# EAGLE design had_ret (EAGLE 6.6.0)
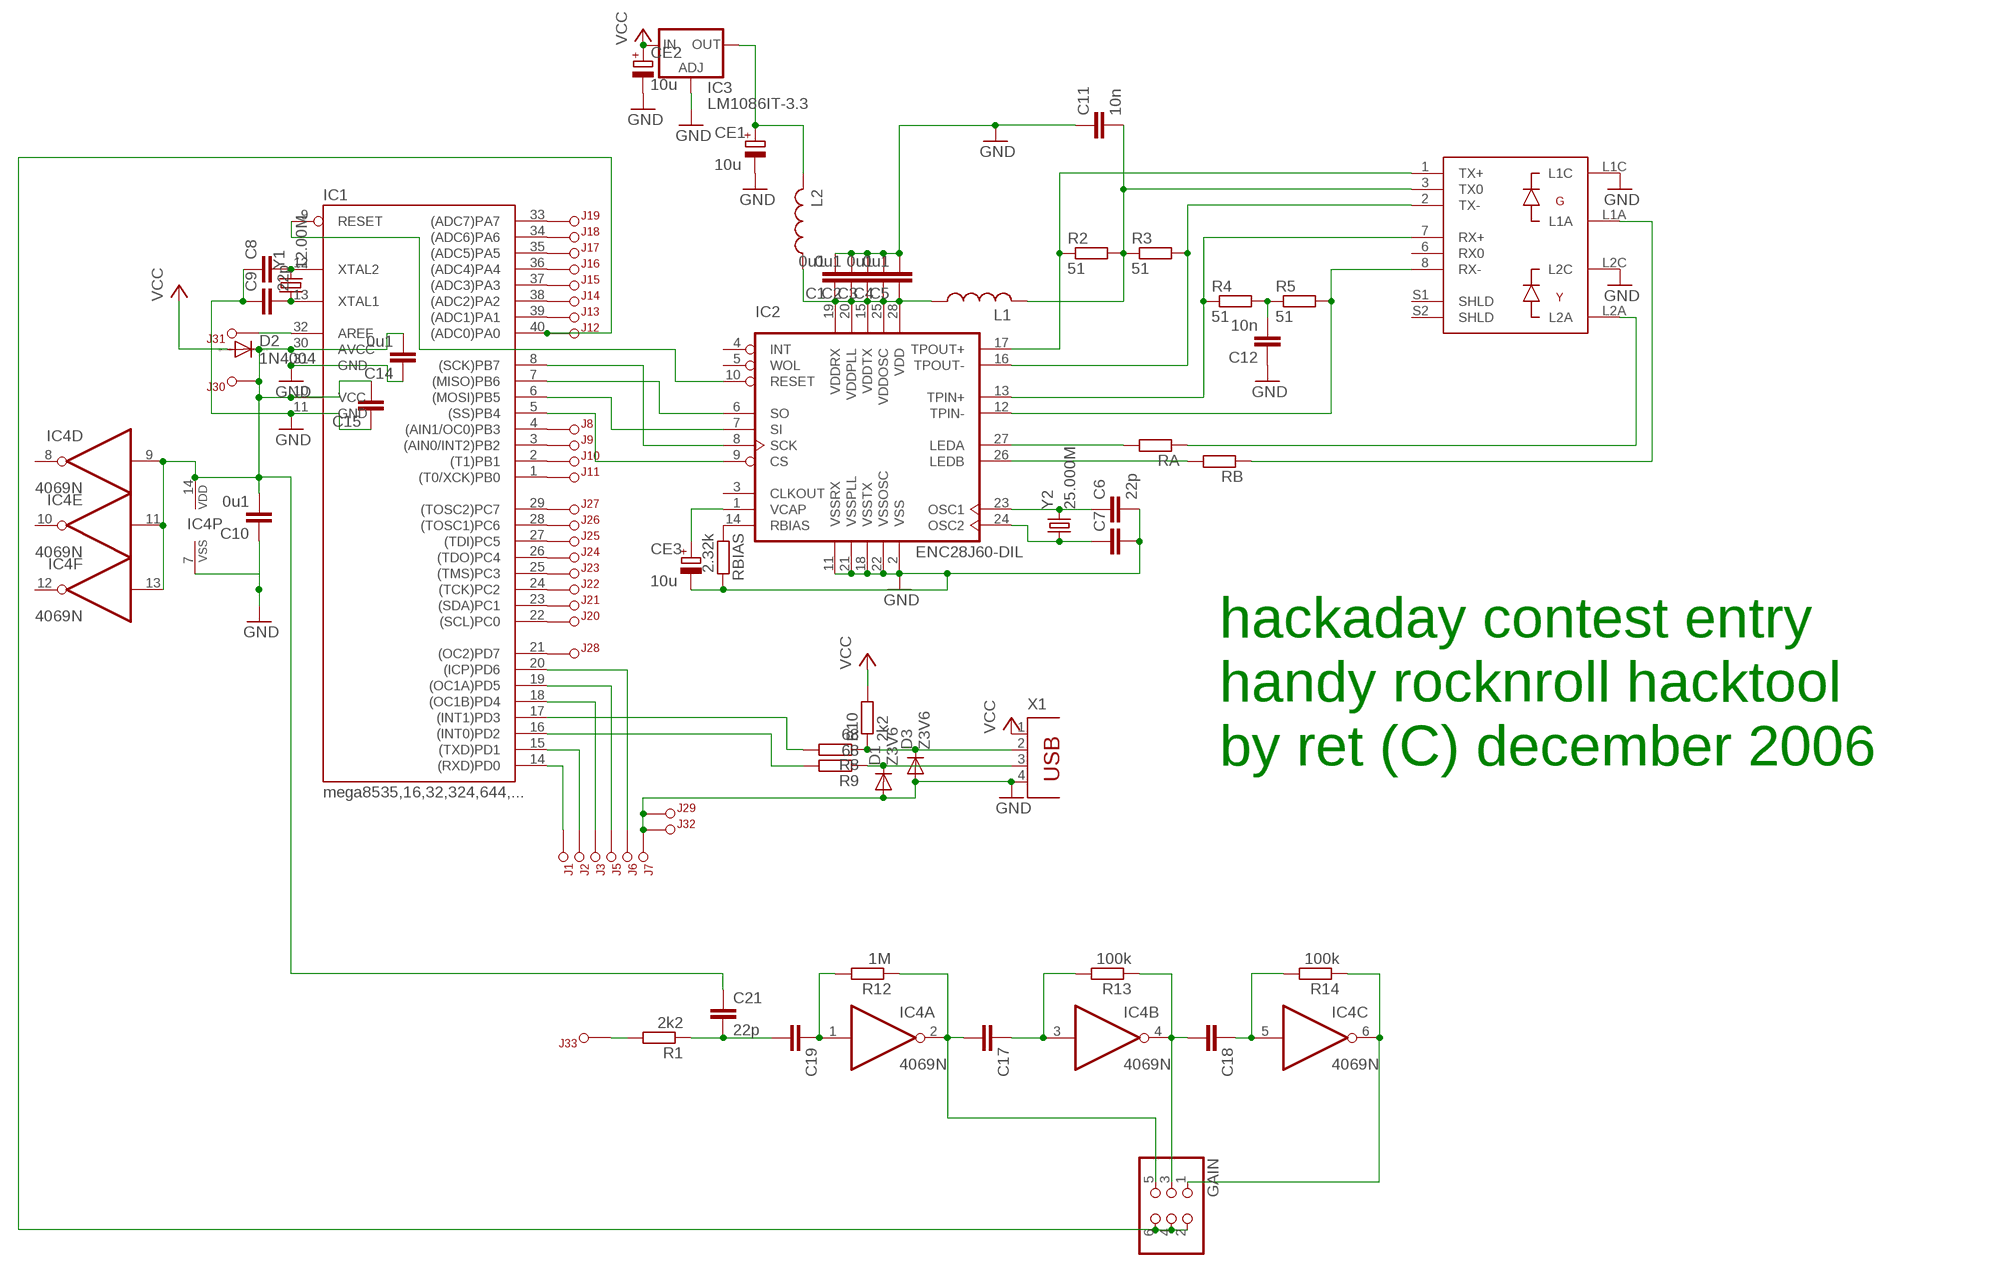
[diagram p0: schematic, sheet 1]

## Parts
C1  0u1  C0805  [0805]
C2  0u1  C0805  [0805]
C3  C0805  [0805]
C4  0u1  C0805  [0805]
C5  0u1  C0805  [0805]
C6  22p  C0805  [0805]
C7  C0805  [0805]
C8  C0805  [0805]
C9  22p  C0805  [0805]
C10  0u1  C0805  [0805]
C11  10n  C0805  [0805]
C12  10n  C0805  [0805]
C14  0u1  C0805  [0805]
C15  C0805  [0805]
C17  C0805  [0805]
C18  C0805  [0805]
C19  C0805  [0805]
C21  22p  C0805  [0805]
CE1  10u  CPOL-EUCT3528  [CT3528]
CE2  10u  CPOL-EUCT3528  [CT3528]
CE3  10u  CPOL-EUCT3528  [CT3528]
D1  Z3V6  DIODE  [DIODE]
D2  1N4004  [DO41-10]
D3  Z3V6  DIODE  [DIODE]
GAIN  PINHD-2X3  [2X03]
IC1  mega8535,16,32,324,644,...  MEGA16-P  [DIL40]
IC2  ENC28J60-DIL  [DIL28-3]
IC3  LM1086IT-3.3  LM317TS  [317TS]
IC4  4069N  [DIL14]
J1  PINMA01  [MA01-1PIN]
J2  PINMA01  [MA01-1PIN]
J3  PINMA01  [MA01-1PIN]
J4  8P8C-TRAF  [8P8C-TRAF]
J5  PINMA01  [MA01-1PIN]
J6  PINMA01  [MA01-1PIN]
J7  PINMA01  [MA01-1PIN]
J8  PINMA01  [MA01-1PIN]
J9  PINMA01  [MA01-1PIN]
J10  PINMA01  [MA01-1PIN]
J11  PINMA01  [MA01-1PIN]
J12  PINMA01  [MA01-1PIN]
J13  PINMA01  [MA01-1PIN]
J14  PINMA01  [MA01-1PIN]
J15  PINMA01  [MA01-1PIN]
J16  PINMA01  [MA01-1PIN]
J17  PINMA01  [MA01-1PIN]
J18  PINMA01  [MA01-1PIN]
J19  PINMA01  [MA01-1PIN]
J20  PINMA01  [MA01-1PIN]
J21  PINMA01  [MA01-1PIN]
J22  PINMA01  [MA01-1PIN]
J23  PINMA01  [MA01-1PIN]
J24  PINMA01  [MA01-1PIN]
J25  PINMA01  [MA01-1PIN]
J26  PINMA01  [MA01-1PIN]
J27  PINMA01  [MA01-1PIN]
J28  PINMA01  [MA01-1PIN]
J29  PINMA01  [MA01-1PIN]
J30  PINMA01  [MA01-1PIN]
J31  PINMA01  [MA01-1PIN]
J32  PINMA01  [MA01-1PIN]
J33  PINMA01  [MA01-1PIN]
L1  L0805  [0805]
L2  L0805  [0805]
R1  2k2  R0805  [0805]
R2  51  R0805  [0805]
R3  51  R0805  [0805]
R4  51  R0805  [0805]
R5  51  R0805  [0805]
R8  68  R0805  [0805]
R9  68  R0805  [0805]
R10  2k2  R0805  [0805]
R12  1M  R0805  [0805]
R13  100k  R0805  [0805]
R14  100k  R0805  [0805]
RA  R-EU_0204/5  [0204/5]
RB  R-EU_0204/5  [0204/5]
RBIAS  2.32k  R-EU_0204/7  [0204/7]
X1  PN61729  [PN61729]
Y1  12.00M  CRYSTALHC49S  [HC49/S]
Y2  25.000M  CRYSTALHC49S  [HC49/S]

## Nets
+3V3: CE1.+ IC3.2(OUT) L2.2
GND: C1.2 C2.2 C3.2 C4.2 C5.2 C6.2 C7.2 C8.1 C9.1 C10.1 C11.1 C12.1 C14.1 C15.1 CE1.- CE2.- CE3.- D1.A D3.A IC1.11(GND) IC1.31(GND) IC2.2(VSS) IC2.11(VSSRX) IC2.18(VSSTX) IC2.21(VSSPLL) IC2.22(VSSOSC) IC3.1(ADJ) IC4.7(P:VSS) J4.L1C J4.L2C J7.1 J29.1 J32.1 RBIAS.2 X1.4
MISO: IC1.7((MISO)PB6) IC2.6(SO)
MOSI: IC1.6((MOSI)PB5) IC2.7(SI)
N$1: IC1.15((TXD)PD1) J2.1
N$2: IC1.14((RXD)PD0) J1.1
N$3: CE3.+ IC2.1(VCAP)
N$4: IC1.17((INT1)PD3) R8.2
N$5: IC1.16((INT0)PD2) R9.2
N$6: C1.1 C2.1 C3.1 C4.1 C5.1 IC2.15(VDDTX) IC2.19(VDDRX) IC2.20(VDDPLL) IC2.25(VDDOSC) IC2.28(VDD) L1.1 L2.1
N$7: IC1.32(AREF) J31.1
N$8: IC2.26(LEDB) RB.2
N$27: IC2.27(LEDA) RA.2
N$28: IC1.18((OC1B)PD4) J3.1
N$31: J4.L2A RA.1
N$32: IC2.16(TPOUT-) J4.2(TX-) R3.2
N$33: IC2.12(TPIN-) J4.8(RX-) R5.2
N$34: IC2.13(TPIN+) J4.7(RX+) R4.1
N$35: C11.2 J4.3(TX0) L1.2 R2.2 R3.1
N$37: C8.2 IC1.12(XTAL2) Y1.2
N$38: C9.2 IC1.13(XTAL1) Y1.1
N$39: C6.1 IC2.23(OSC1) Y2.2
N$40: C7.1 IC2.24(OSC2) Y2.1
N$41: IC2.17(TPOUT+) J4.1(TX+) R2.1
N$42: J4.L1A RB.1
N$43: IC2.14(RBIAS) RBIAS.1
N$44: IC1.19((OC1A)PD5) J5.1
N$45: IC1.20((ICP)PD6) J6.1
N$46: D3.K(C) R8.1 R10.1 X1.2
N$47: D1.K(C) R9.1 X1.3
N$48: IC1.4((AIN1/OC0)PB3) J8.1
N$49: IC1.3((AIN0/INT2)PB2) J9.1
N$50: IC1.2((T1)PB1) J10.1
N$51: IC1.1((T0/XCK)PB0) J11.1
N$52: GAIN.2 GAIN.4 GAIN.6 IC1.40((ADC0)PA0) J12.1
N$53: IC1.39((ADC1)PA1) J13.1
N$54: IC1.38((ADC2)PA2) J14.1
N$55: IC1.37((ADC3)PA3) J15.1
N$56: IC1.36((ADC4)PA4) J16.1
N$57: IC1.35((ADC5)PA5) J17.1
N$58: IC1.34((ADC6)PA6) J18.1
N$59: IC1.33((ADC7)PA7) J19.1
N$60: IC1.22((SCL)PC0) J20.1
N$61: IC1.23((SDA)PC1) J21.1
N$62: IC1.24((TCK)PC2) J22.1
N$63: IC1.25((TMS)PC3) J23.1
N$64: IC1.26((TDO)PC4) J24.1
N$65: IC1.27((TDI)PC5) J25.1
N$66: IC1.28((TOSC1)PC6) J26.1
N$67: IC1.29((TOSC2)PC7) J27.1
N$68: IC1.21((OC2)PD7) J28.1
N$69: C12.2 R4.2 R5.1
N$72: C19.1 IC4.1(A:I) R12.2
N$73: C17.2 GAIN.5 IC4.2(A:O) R12.1
N$77: C17.1 IC4.3(B:I) R13.2
N$78: C18.2 GAIN.3 IC4.4(B:O) R13.1
N$80: J33.1 R1.2
N$81: C19.2 C21.2 R1.1
N$82: C18.1 IC4.5(C:I) R14.2
N$83: GAIN.1 IC4.6(C:O) R14.1
RST: IC1.9(RESET) IC2.10(RESET)
SCK: IC1.8((SCK)PB7) IC2.8(SCK)
SS: IC1.5((SS)PB4) IC2.9(CS)
V4.4: C10.2 C14.2 C15.2 C21.1 D2.C IC1.10(VCC) IC1.30(AVCC) IC4.9(D:I) IC4.11(E:I) IC4.13(F:I) IC4.14(P:VDD) J30.1
VCC: CE2.+ D2.A IC3.3(IN) R10.2 X1.1
Unconnected: IC2.3(CLKOUT) IC2.4(INT) IC2.5(WOL) IC4.8(D:O) IC4.10(E:O) IC4.12(F:O) J4.6(RX0) J4.S1(SHLD) J4.S2(SHLD)

## Notes on the sheet
- hackaday contest entry
- handy rocknroll hacktool
- by ret (C) december 2006

## Library data of the parts
C1-C12 C14 C15 C17-C19 C21 = 042_ret:C
CE1-CE3 = rcl:CPOL-EU: POLARIZED CAPACITOR, European symbol
D1 D3 = 042_ret:DIODE
D2 = diode:1N4004: DIODE general purpose rectifier, 1 A
GAIN = pinhead:PINHD-2X3: PIN HEADER
IC1 = atmel:MEGA16-P: MICROCONTROLLER 16 Kbytes FLASH 1 kbytes SRAM 512 bytes EEPROM USART 8-channel 10 bit ADC Source: avr.lbr; MPN: ATMEGA16-16PU; OC_FARNELL: 9171142; OC_NEWARK: 01M6885
IC2 = microchip-enc28j60:ENC28J60-*: Microchip 10Mbit Eth. contoller with SPI interface
IC3 = v-reg:LM317TS: VOLTAGE REGULATOR
IC4 = 40xx:4069: Hex INVERTER
J1-J3 J5-J33 = 042_ret:PIN
J4 = 042_ret:8P8C-TRAF
L1 L2 = 042_ret:L
R1-R5 R8-R10 R12-R14 = 042_ret:R
RA RB RBIAS = rcl:R-EU_: RESISTOR, European symbol
X1 = con-berg:PN61729: BERG USB connector; OC_FARNELL: unknown; OC_NEWARK: unknown
Y1 Y2 = crystal:CRYSTAL: CRYSTAL; OC_FARNELL: 1667008; OC_NEWARK: unknown

## Board
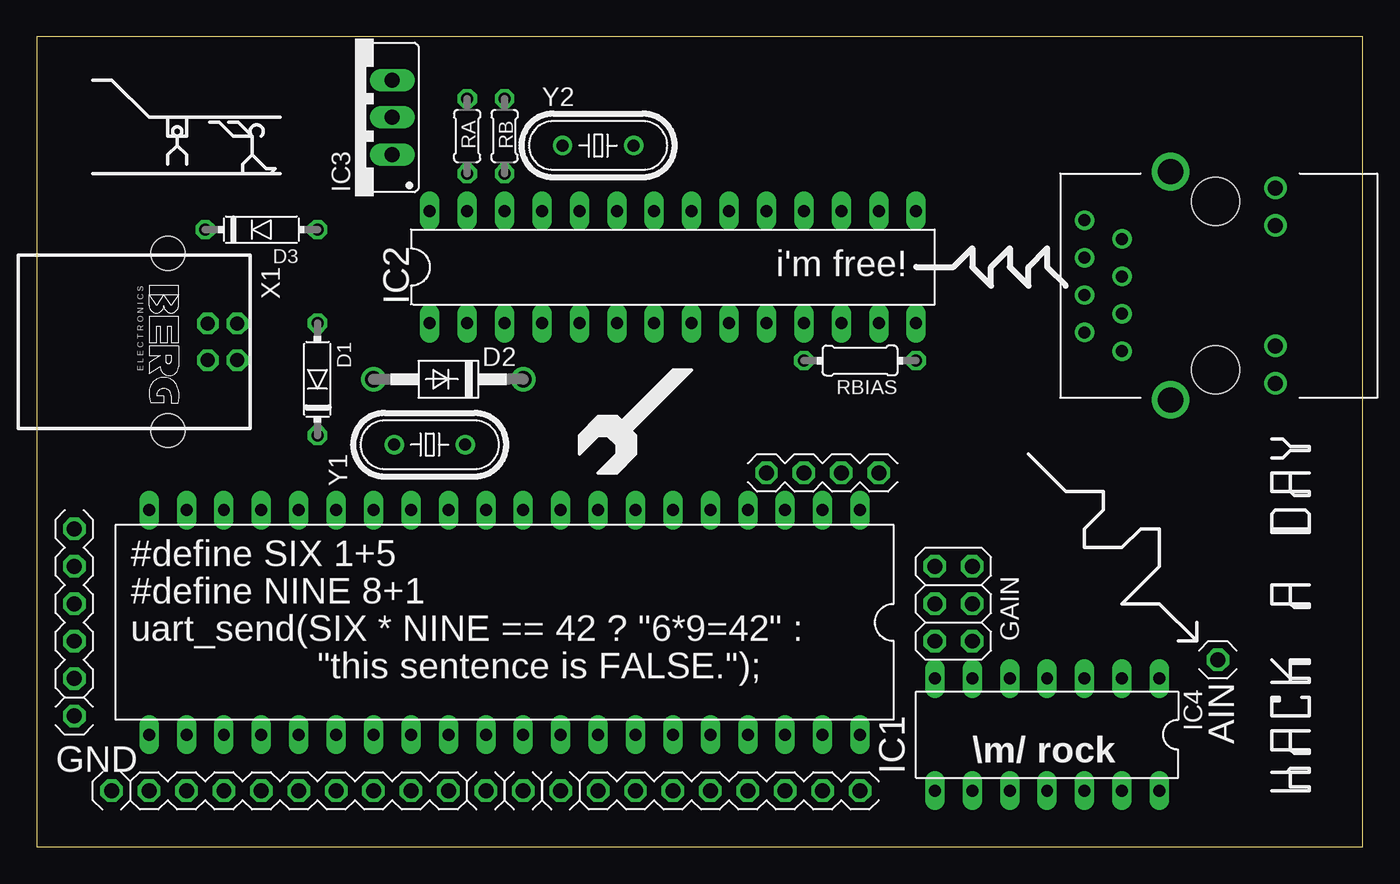
[diagram p1: board, top side]
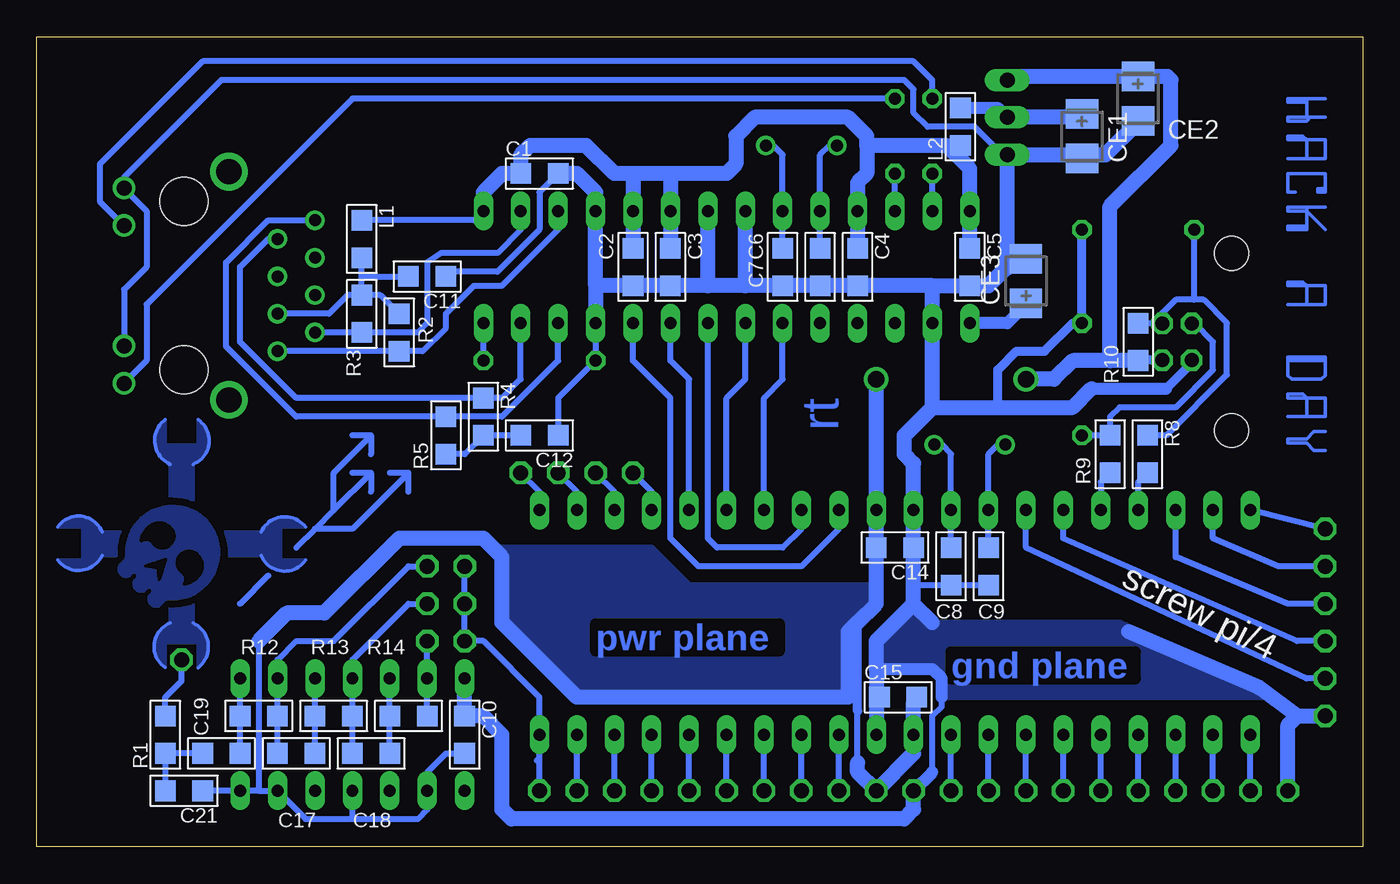
[diagram p2: board, bottom side, seen from below]

Size 90 x 55 mm. Coordinates in mm from the lower left corner, seen from the top.
Outline: 0,0 90,0 90,55 0,55 0,0
Copper layers (1*16): Top 0.035mm / dielectric 1.5mm / Bottom 0.035mm
Design rules "olimex8mil *": minimum track width 10mil, minimum drill 24mil, track to track 8mil, track to pad 8mil, pad to pad 8mil, via to via 8mil, smd to smd 8mil, copper to edge 15mil, drill to drill 10mil, minimum pad ring 10mil, minimum via ring 8mil, stop-mask expansion 0mil, vias tented up to drill 0mil, thermal gap 10mil
bRestrict: area 78.8,17.8 to 80.5,20.1; area 80.7,20.3 to 82.9,22; area 81.3,18.2 to 82.6,19.5; 3 lines

### Footprints (pad centres in the part's own frame; a part is rotated, then mirrored left to right if it is on the bottom)
0805 = smd 1.4 x 1.4: 1 -1.27,0; 2 1.27,0
CT3528 = smd 2 x 2.2: + -1.5,0; - 1.5,0
DIODE = drill 0.813 octagon: A -3.81,0; K 3.81,0
DO41-10 = drill 1.118: A 5.08,0; C -5.08,0
2X03 = drill 1.016 octagon: 1 -2.54,-1.27; 2 -2.54,1.27; 3 0,-1.27; 4 0,1.27; 5 2.54,-1.27; 6 2.54,1.27
DIL40 = drill 0.813 long: 1 -24.13,-7.62; 2 -21.59,-7.62; 3 -19.05,-7.62; 4 -16.51,-7.62; 5 -13.97,-7.62; 6 -11.43,-7.62; 7 -8.89,-7.62; 8 -6.35,-7.62; 9 -3.81,-7.62; 10 -1.27,-7.62; 11 1.27,-7.62; 12 3.81,-7.62; 13 6.35,-7.62; 14 8.89,-7.62; 15 11.43,-7.62; 16 13.97,-7.62; 17 16.51,-7.62; 18 19.05,-7.62; 19 21.59,-7.62; 20 24.13,-7.62; 21 24.13,7.62; 22 21.59,7.62; 23 19.05,7.62; 24 16.51,7.62; 25 13.97,7.62; 26 11.43,7.62; 27 8.89,7.62; 28 6.35,7.62; 29 3.81,7.62; 30 1.27,7.62; 31 -1.27,7.62; 32 -3.81,7.62; 33 -6.35,7.62; 34 -8.89,7.62; 35 -11.43,7.62; 36 -13.97,7.62; 37 -16.51,7.62; 38 -19.05,7.62; 39 -21.59,7.62; 40 -24.13,7.62
DIL28-3 = drill 0.813 long: 1 -16.51,-3.81; 2 -13.97,-3.81; 3 -11.43,-3.81; 4 -8.89,-3.81; 5 -6.35,-3.81; 6 -3.81,-3.81; 7 -1.27,-3.81; 8 1.27,-3.81; 9 3.81,-3.81; 10 6.35,-3.81; 11 8.89,-3.81; 12 11.43,-3.81; 13 13.97,-3.81; 14 16.51,-3.81; 15 16.51,3.81; 16 13.97,3.81; 17 11.43,3.81; 18 8.89,3.81; 19 6.35,3.81; 20 3.81,3.81; 21 1.27,3.81; 22 -1.27,3.81; 23 -3.81,3.81; 24 -6.35,3.81; 25 -8.89,3.81; 26 -11.43,3.81; 27 -13.97,3.81; 28 -16.51,3.81
317TS = drill 1.016 long: 1 -2.54,-2.54; 2 0,-2.54; 3 2.54,-2.54
DIL14 = drill 0.813 long: 1 -7.62,-3.81; 2 -5.08,-3.81; 3 -2.54,-3.81; 4 0,-3.81; 5 2.54,-3.81; 6 5.08,-3.81; 7 7.62,-3.81; 8 7.62,3.81; 9 5.08,3.81; 10 2.54,3.81; 11 0,3.81; 12 -2.54,3.81; 13 -5.08,3.81; 14 -7.62,3.81
MA01-1PIN = drill 1.016 octagon: 1 0,0
8P8C-TRAF = drill 0.813: 1 -4.445,6.35; 2 -3.175,8.89; 3 -1.905,6.35; 4 -0.635,8.89; 5 0.635,6.35; 6 1.905,8.89; 7 3.175,6.35; 8 4.445,8.89 | drill 1.016: L1A -6.629,-4.064; L1C -4.089,-4.064; L2A 4.089,-4.064; L2C 6.629,-4.064 | drill 1.702: S1 -7.747,3.048; S2 7.747,3.048 | hole 3.251: -5.715,0; 5.715,0
0204/5 = drill 0.813 octagon: 1 -2.54,0; 2 2.54,0
0204/7 = drill 0.813 octagon: 1 -3.81,0; 2 3.81,0
PN61729 = drill 0.95 octagon: 1 1.25,4.71; 2 -1.25,4.71; 3 -1.25,2.71; 4 1.25,2.71 | hole 2.3: -6.02,0; 6.02,0
HC49/S = drill 0.813: 1 -2.413,0; 2 2.413,0

### Placement (x,y rotation side)
C1  55.88,45.72 0 bottom
C2  49.53,39.37 270 bottom
C3  46.99,39.37 270 bottom
C4  34.29,39.37 270 bottom
C5  26.67,39.37 270 bottom
C6  39.37,39.37 270 bottom
C7  36.83,39.37 270 bottom
C8  27.94,19.05 90 bottom
C9  25.4,19.05 90 bottom
C10  60.96,7.62 270 bottom
C11  63.5,38.73 180 bottom
C12  55.88,27.94 180 bottom
C14  31.75,20.32 180 bottom
C15  31.53,10.16 0 bottom
C17  72.39,6.35 180 bottom
C18  67.31,6.35 180 bottom
C19  77.47,6.35 180 bottom
C21  80.01,3.81 180 bottom
CE1  19.05,48.26 270 bottom
CE2  15.24,50.8 270 bottom
CE3  22.86,38.42 90 bottom
D1  19.05,31.75 270 top
D2  27.94,31.75 180 top
D3  15.24,41.91 180 top
GAIN  62.23,16.51 90 top
IC1  31.75,15.24 180 top
IC2  43.18,39.37 0 top
IC3  21.59,49.53 90 top
IC4  68.58,7.62 180 top
J1  2.54,11.43 90 top
J2  2.54,13.97 90 top
J3  2.54,16.51 90 top
J4  80.01,38.1 90 top
J5  2.54,19.05 90 top
J6  2.54,21.59 90 top
J7  2.54,8.89 180 top
J8  49.53,25.4 180 top
J9  52.07,25.4 180 top
J10  54.61,25.4 0 top
J11  57.15,25.4 0 top
J12  55.88,3.81 180 top
J13  53.34,3.81 180 top
J14  50.8,3.81 180 top
J15  48.26,3.81 180 top
J16  45.72,3.81 180 top
J17  43.18,3.81 180 top
J18  40.64,3.81 180 top
J19  38.1,3.81 180 top
J20  10.16,3.81 0 top
J21  12.7,3.81 180 top
J22  15.24,3.81 180 top
J23  17.78,3.81 180 top
J24  20.32,3.81 180 top
J25  22.86,3.81 180 top
J26  25.4,3.81 180 top
J27  27.94,3.81 180 top
J28  7.62,3.81 0 top
J29  5.08,3.81 90 top
J30  33.02,3.81 90 top
J31  35.56,3.81 90 top
J32  30.48,3.81 90 top
J33  80.17,12.7 0 top
L1  67.94,41.27 270 bottom
L2  27.3,48.9 90 bottom
R1  81.28,7.62 90 bottom
R2  65.41,34.92 90 bottom
R3  67.94,36.2 270 bottom
R4  59.69,29.21 270 bottom
R5  62.23,27.94 90 bottom
R8  14.61,26.67 270 bottom
R9  17.14,26.67 270 bottom
R10  15.24,34.29 270 bottom
R12  74.93,8.89 180 bottom
R13  69.85,8.89 180 bottom
R14  64.77,8.89 180 bottom
RA  29.21,48.26 270 top
RB  31.75,48.26 270 top
RBIAS  55.88,33.02 180 top
X1  8.89,34.29 270 top
Y1  26.67,27.3 0 top
Y2  38.1,47.62 0 top

### Tracks (layer width: path | path; a pad name or v marks a point on that pad's centre or on a via)
+3V3
  Bottom 0.813: IC3.2 24.77,50.16 L2.2
  Bottom 1.016: CE1.+ 19.05,49.53 IC3.2
GND
  Bottom 0.406: C9.1 C8.1 30.48,17.78 | IC2.11 RBIAS.2 54.61,30.48 C12.1 | C1.2 55.88,44.45 55.88,41.91 58.74,39.05 61.91,39.05 C11.1 | J4.L1C 84.07,37.85 82.55,39.37 82.55,43.18 84.07,44.7 J4.L2C 84.07,45.47 77.47,52.07 31.11,52.07 30.48,51.44 30.48,49.85 29.53,48.9 26.35,48.9 24.45,46.99 IC3.1 | 29.21,5.08 29.21,8.89 28.57,9.53 28.57,10.16
  Bottom 0.61: X1.4 11.6,32.85 13.34,31.11 | D3.A D1.A 19.68,35.56 21.59,33.66 23.5,33.66 24.77,32.38 24.77,29.84
  Bottom 0.813: 18.41,31.11 13.34,31.11 | 24.22,39.28 24.13,39.28 | J32.1 29.21,5.08 | 28.57,10.16 28.57,11.43 29.21,12.06 33.02,12.06
  Bottom 1.016: 30.48,16.51 30.48,17.78 C14.1 IC1.11 30.48,26.04 31.11,26.67 31.11,27.94 29.21,29.84 | 30.48,16.51 33.02,13.97 33.02,12.06 33.02,10.16 | 33.02,10.16 IC1.31 | 18.41,31.11 19.68,29.84 24.77,29.84 29.21,29.84 | 29.21,38.1 C5.2 25.4,38.1 24.22,39.28 | 29.21,38.1 C4.2 C7.2 C6.2 41.91,38.1 | 41.91,38.1 44.45,38.1 | 44.45,38.1 C3.2 C2.2 52.07,38.1 | 52.07,38.1 IC2.11 | 52.07,38.1 IC2.18 52.07,44.45 53.34,45.72 C1.2 | 44.45,38.1 IC2.21 | 41.91,38.1 IC2.22 | 29.21,38.1 IC2.2 29.21,29.84 | 33.02,10.16 C15.1 | CE3.- 24.13,39.28 IC3.1 19.05,46.99 | 19.05,46.99 CE1.- | 19.05,46.99 17.46,46.99 15.24,49.21 CE2.- 15.24,49.53 | 4.45,8.89 J7.1 | 30.48,16.51 29.21,15.24 | J29.1 5.08,8.26 4.45,8.89 | J32.1 30.48,2.54 31.11,1.91 57.78,1.91 58.42,2.54 58.42,7.62 59.69,8.89 C10.1 IC4.7 | 4.45,8.89 6.99,10.79 15.88,14.61
  pour Bottom (isolate 0.406): 5.71,10.16 28.57,10.16 28.57,11.43 29.21,12.06 33.02,12.06 33.02,13.97 30.48,16.51 29.21,15.24 16.51,15.24
MISO
  Bottom 0.406: IC2.6 39.37,31.75 40.64,30.48 IC1.7
MOSI
  Bottom 0.406: IC2.7 41.91,31.75 43.18,30.48 IC1.6
N$1
  Bottom 0.406: J2.1 4.45,13.97 20.32,20.95 IC1.15
N$2
  Bottom 0.406: J1.1 3.81,11.43 22.86,20.32 IC1.14
N$3
  Bottom 0.813: CE3.+ 23.41,36.28 24.13,35.56 IC2.1
N$4
  Bottom 0.406: IC1.17 15.24,24.77 R8.2
N$5
  Bottom 0.406: R9.2 17.78,24.77 IC1.16
N$6
  Bottom 0.406: L1.1 60.33,42.55 IC2.15
  Bottom 1.016: C5.1 IC2.28 26.67,46.04 28.26,47.62 | C2.1 IC2.19 49.53,45.72 | C3.1 IC2.20 46.99,45.72 | C4.1 IC2.25 34.29,45.09 33.66,45.72 33.66,47.62 | IC2.15 59.69,44.45 58.42,45.72 C1.1 57.15,46.99 56.52,47.62 52.7,47.62 50.8,45.72 49.53,45.72 | 46.99,45.72 43.18,45.72 42.55,46.35 42.55,48.26 41.27,49.53 34.92,49.53 33.66,48.26 33.66,47.62 | 46.99,45.72 49.53,45.72 | 28.26,47.62 33.66,47.62 | 28.26,47.62 L2.1
N$7
  Bottom 0.406: J31.1 IC1.32
N$8
  Bottom 0.406: IC2.26 RB.2
N$9
  pour Bottom: 83.71,19.75 84.27,19.19 arc-180 83.6,18.51 83.49,18.63 arc180 83.15,18.29 83.26,18.18 arc-180 82.59,17.5 82.48,17.62 arc180 82.14,17.28 82.25,17.17 arc-180 81.58,16.49 81.02,17.05
N$10
  pour Bottom (no thermals): 78.55,22.22 arc-90 83.04,22.22 arc-180 78.55,17.73 arc-90
N$17
  Bottom 0.254: 3.81,50.8 2.54,50.8 | 3.81,50.8 5.08,50.8 5.08,50.55 3.81,50.55 | 3.81,50.55 3.81,50.8 | 3.81,49.53 3.81,50.55 | 3.56,49.53 3.81,49.53 | 3.56,49.53 2.54,49.53 | 3.81,49.53 5.08,49.53 5.08,49.28 3.81,49.28 3.56,49.53
N$19
  Bottom 0.254: 3.81,48.01 5.08,48.01 5.08,48.26 4.06,48.26 3.81,48.01 | 3.81,48.01 2.54,48.01 2.54,46.74 3.81,46.74 | 3.81,46.74 5.08,46.74 | 3.81,48.01 3.81,46.74
N$20
  Bottom 0.254: 2.54,44.7 2.54,45.72 5.08,45.72 5.08,44.45 4.57,44.45 | 2.54,44.7 2.54,44.45 3.05,44.45 3.05,44.7 2.54,44.7
N$21
  Bottom 0.254: 3.81,43.43 2.54,43.43 | 3.81,43.43 5.08,43.43 5.08,43.18 3.81,43.18 | 3.81,43.18 3.81,43.43 | 3.81,43.18 3.81,42.16 | 3.81,42.16 5.08,42.16 5.08,41.91 3.81,41.91 3.81,42.16 | 2.54,41.91 3.81,43.18
N$23
  Bottom 0.254: 5.08,33.02 2.54,33.02 | 2.54,33.02 2.54,32 2.79,31.75 4.83,31.75 5.08,32 5.08,33.02 | 5.08,33.02 5.08,33.27 2.54,33.27 2.54,33.02
N$24
  Bottom 0.254: 3.81,38.1 5.08,38.1 5.08,38.35 4.06,38.35 3.81,38.1 | 3.81,38.1 2.54,38.1 2.54,36.83 3.81,36.83 | 3.81,36.83 5.08,36.83 | 3.81,36.83 3.81,38.1
N$25
  Bottom 0.254: 3.81,30.48 5.08,30.48 5.08,30.73 4.06,30.73 3.81,30.48 | 3.81,30.48 2.54,30.48 2.54,29.21 3.81,29.21 | 3.81,29.21 5.08,29.21 | 3.81,29.21 3.81,30.48
N$26
  Bottom 0.254: 2.54,28.19 3.3,28.19 3.81,27.69 5.08,27.69 5.08,27.43 3.81,27.43 3.3,26.92 2.54,26.92
N$27
  Bottom 0.406: IC2.27 RA.2
N$28
  Bottom 0.406: J3.1 5.08,16.51 12.7,19.68 IC1.18
N$31
  Bottom 0.406: RA.1 29.21,52.07 30.48,53.34 78.74,53.34 85.72,46.35 85.72,43.81 84.1,42.19 J4.L2A
N$32
  Bottom 0.406: J4.2 R3.2 64.14,34.92 63.5,35.56 63.5,39.69 62.55,40.32 58.74,40.32 57.15,41.91 IC2.16
N$33
  Bottom 0.406: J4.8 74.3,42.55 77.15,39.69 77.15,33.97 72.39,29.21 R5.2 58.42,29.21 54.61,33.02 IC2.12
N$34
  Bottom 0.406: J4.7 74.3,41.27 76.2,39.37 76.2,34.29 72.39,30.48 R4.1 58.42,30.48 57.15,31.75 IC2.13
N$35
  Bottom 0.406: R3.1 68.9,37.47 70.17,36.2 J4.3 | R2.2 66.67,37.47 R3.1 | R3.1 67.94,38.73 | 67.94,38.73 L1.2 | 67.94,38.73 C11.2
N$37
  Bottom 0.406: Y1.2 28.57,27.3 27.94,26.67 IC1.12 C8.2
N$38
  Bottom 0.406: Y1.1 24.77,27.3 25.4,26.67 IC1.13 C9.2
N$39
  Bottom 0.406: Y2.2 40.01,47.62 39.37,46.99 IC2.23 C6.1
N$40
  Bottom 0.406: Y2.1 36.2,47.62 36.83,46.99 IC2.24 C7.1
N$41
  Bottom 0.406: J4.1 R2.1 63.82,33.66 62.23,35.24 62.23,36.2 60.33,38.1 58.42,38.1 54.61,41.91 IC2.17
N$42
  Bottom 0.406: RB.1 68.58,50.8 82.55,36.83 82.55,33.02 84.07,31.5 J4.L1A
N$43
  Bottom 0.406: RBIAS.1 IC2.14
N$44
  Bottom 0.406: J5.1 5.71,19.05 10.16,20.95 IC1.19
N$45
  Bottom 0.406: J6.1 IC1.20
N$46
  Bottom 0.406: R10.1 15.54,35.54 X1.2 13.6,36.25 12.7,37.15 11.43,37.15 | 11.43,37.15 10.79,37.15 9.21,35.56 9.21,32.07 13.34,27.94 R8.1 | 11.43,37.15 D3.K
N$47
  Bottom 0.406: X1.3 11.41,35.54 10.16,34.29 10.16,32.38 12.7,29.84 16.51,29.84 17.14,29.21 R9.1 D1.K
N$48
  Bottom 0.406: IC1.4 48.26,24.13 J8.1
N$49
  Bottom 0.406: IC1.3 50.8,24.13 J9.1
N$50
  Bottom 0.406: IC1.2 53.34,24.13 J10.1
N$51
  Bottom 0.406: IC1.1 55.88,24.13 J11.1
N$52
  Bottom 0.406: J12.1 55.88,6.03 | 55.88,6.03 IC1.40 55.88,10.16 59.69,13.97 GAIN.2 GAIN.4 GAIN.6 | 55.88,6.03 56.05,5.87
N$53
  Bottom 0.406: J13.1 IC1.39
N$54
  Bottom 0.406: J14.1 IC1.38
N$55
  Bottom 0.406: J15.1 IC1.37
N$56
  Bottom 0.406: J16.1 IC1.36
N$57
  Bottom 0.406: J17.1 IC1.35
N$58
  Bottom 0.406: J18.1 IC1.34
N$59
  Bottom 0.406: J19.1 IC1.33
N$60
  Bottom 0.406: J20.1 IC1.22
N$61
  Bottom 0.406: J21.1 IC1.23
N$62
  Bottom 0.406: J22.1 IC1.24
N$63
  Bottom 0.406: J23.1 IC1.25
N$64
  Bottom 0.406: J24.1 IC1.26
N$65
  Bottom 0.406: J25.1 IC1.27
N$66
  Bottom 0.406: J26.1 IC1.28
N$67
  Bottom 0.406: J27.1 IC1.29
N$68
  Bottom 0.406: J28.1 IC1.21
N$69
  Bottom 0.406: C12.2 R4.2 60.96,26.67 R5.1
N$70
  Bottom 0.406: 69.85,22.86 67.31,25.4 | 71.12,21.59 69.85,22.86 | 71.12,21.59 72.39,20.32 | 69.85,22.86 69.85,25.4 67.31,27.94 | 67.31,27.94 67.31,26.67 | 67.31,27.94 68.58,27.94 | 71.12,21.59 68.58,21.59 64.77,25.4 | 67.31,25.4 67.31,24.13 | 67.31,25.4 68.58,25.4 | 64.77,24.13 64.77,25.4 | 64.77,25.4 66.04,25.4
N$71
  Bottom 0.406: 74.3,18.41 76.2,16.51
N$72
  Bottom 0.406: IC4.1 R12.2 C19.1
N$73
  Bottom 0.406: C17.2 R12.1 IC4.2 73.66,12.7 72.39,13.97 69.85,13.97 64.77,19.05 GAIN.5
N$77
  Bottom 0.406: IC4.3 R13.2 C17.1
N$78
  Bottom 0.406: C18.2 R13.1 IC4.4 68.58,12.7 64.77,16.51 GAIN.3
N$80
  Bottom 0.406: J33.1 80.17,11.27 81.28,10.16 R1.2
N$81
  Bottom 0.406: C21.2 R1.1 C19.2
N$82
  Bottom 0.406: IC4.5 R14.2 C18.1
N$83
  Bottom 0.406: GAIN.1 IC4.6 R14.1
RST
  Bottom 0.406: IC2.10 49.53,33.02 46.99,30.48 46.99,20.95 45.09,19.05 38.1,19.05 35.56,21.59 IC1.9
SCK
  Bottom 0.406: IC2.8 44.45,20.95 43.81,20.32 39.37,20.32 38.1,21.59 IC1.8
SS
  Bottom 0.406: IC2.9 46.99,33.02 45.72,31.75 IC1.5
V4.4
  Bottom 0.406: 34.29,5.71 34.29,9.21 | 74.93,3.81 IC4.13 71.75,1.91 68.58,1.91 | 74.93,3.81 IC4.14 C21.1 | 68.58,1.91 64.14,1.91 63.5,2.54 IC4.9 63.5,5.08 62.23,6.35 C10.2 | 68.58,1.91 IC4.11 | 74.93,13.97 74.93,3.81
  Bottom 0.61: 34.29,9.21 34.29,15.24
  Bottom 1.016: D2.C IC1.10 C14.2 33.02,16.51 34.29,15.24 34.92,14.61 34.92,10.16 53.34,10.16 58.42,15.24 58.42,19.68 59.69,20.95 65.41,20.95 70.48,15.88 73.03,15.88 74.93,13.97 | C15.2 30.48,9.84 IC1.30 30.48,6.35 J30.1 34.29,5.08 34.29,5.71
  pour Bottom (isolate 0.406): 33.02,16.51 34.29,15.24 34.29,10.16 53.34,10.16 58.42,15.24 58.42,20.32 48.26,20.32 45.72,17.78 33.02,17.78
VCC
  Bottom 0.406: 15.22,33.04 R10.2
  Bottom 0.61: X1.1 15.22,33.04
  Bottom 1.016: R10.2 17.14,33.02 | 17.14,33.02 19.68,33.02 20.95,31.75 D2.A | IC3.3 23.9,52.3 CE2.+ 13.25,52.3 13.02,52.07 13.02,47.62 17.14,43.5 17.14,33.02
WW
  Bottom 0.254: 80.96,25.98 arc118 81.3,29.01 | 79.39,25.98 arc-124 79.05,29.01
  pour Bottom: 80.96,25.98 80.96,20.59 79.39,20.59 79.39,25.98 78.6,26.76 78.38,27.44 78.49,28 78.83,28.79 79.05,29.01 79.05,27.3 81.3,27.3 81.3,29.01 81.41,28.9 81.75,28.34 81.86,28 81.86,27.33 81.75,26.99 81.75,26.99 81.63,26.65 81.52,26.54
WW1
  Bottom 0.254: 79.05,12.17 arc-118 79.39,15.2 | 81.3,12.17 arc124 80.96,15.2
  pour Bottom: 79.39,15.2 79.39,20.59 80.96,20.59 80.96,15.2 81.75,14.42 81.97,13.74 81.86,13.18 81.52,12.4 81.3,12.17 81.3,13.88 79.05,13.88 79.05,12.17 78.94,12.28 78.6,12.84 78.49,13.18 78.49,13.86 78.6,14.19 78.6,14.19 78.72,14.53 78.83,14.64
WW2
  Bottom 0.254: 71.76,21.71 arc-118 74.79,21.38 | 71.76,19.47 arc124 74.79,19.8
  pour Bottom: 74.79,21.38 80.17,21.38 80.17,19.8 74.79,19.8 74,19.02 73.33,18.79 72.77,18.91 71.98,19.24 71.76,19.47 73.46,19.47 73.46,21.71 71.76,21.71 71.87,21.83 72.43,22.16 72.77,22.27 73.44,22.27 73.78,22.16 74.11,22.05 74.23,21.94
WW3
  Bottom 0.254: 85.56,19.8 arc118 88.59,19.47 | 85.56,21.38 arc-124 88.59,21.71
  pour Bottom: 85.56,19.8 80.17,19.8 80.17,21.38 85.56,21.38 86.35,22.16 87.02,22.39 87.58,22.27 88.37,21.94 88.59,21.71 86.89,21.71 86.89,19.47 88.59,19.47 88.48,19.36 87.92,19.02 87.58,18.91 86.91,18.91 86.57,19.02 86.57,19.02 86.24,19.13

### Text on the board
Bottom: rt | pwr plane | gnd plane
tPlace: i'm free! | #define SIX 1+5 | #define NINE 8+1 | uart_send(SIX * NINE == 42 ? "6*9=42" : | "this sentence is FALSE."); | AIN | \\m/ rock | GND
bPlace: screw pi/4